# Altium schematic sheet 06_RFID_RTC_Storage.SchDoc: RFID_RTC_Storage
size A4; DrawnBy: YILDIRIM_DOGRU
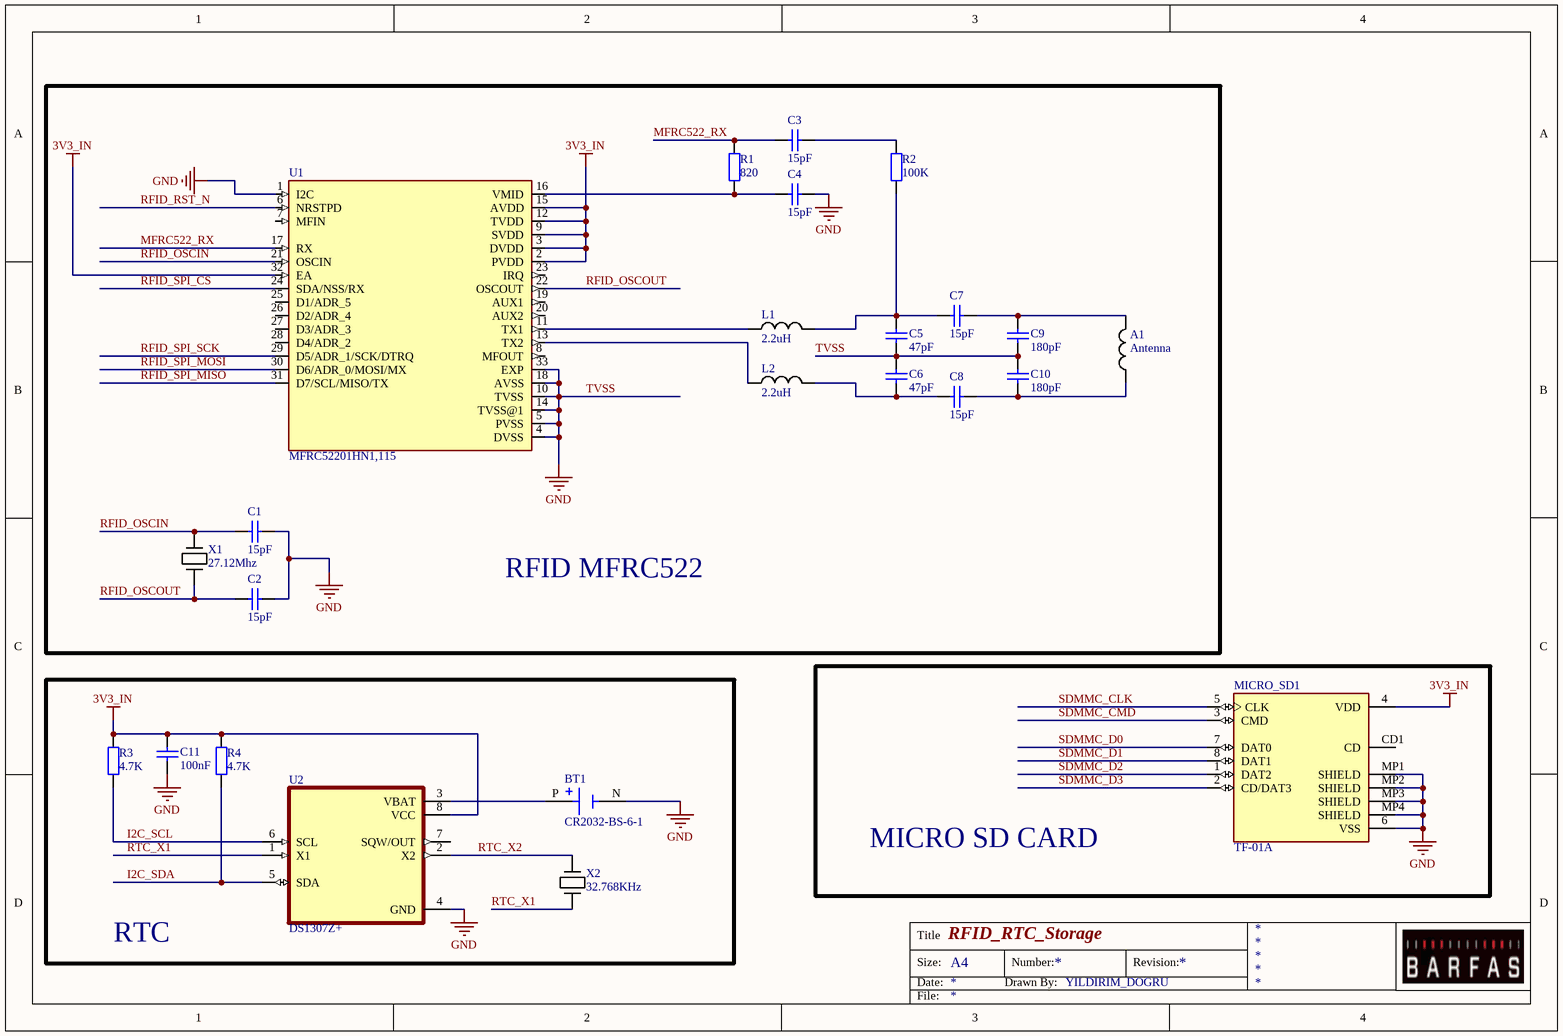
[diagram p0: 06_RFID_RTC_Storage.SchDoc]

## Parts
A1  Antenna  [TDK-VLS3012-1U]
BT1  CR2032-BS-6-1  [BAT_CR2032-BS-6-1]
C1  value 15pF  [RAD-0.3]  (hidden comment: Cap)
C2  value 15pF  [RAD-0.3]  (hidden comment: Cap)
C3  value 15pF  [RAD-0.3]  (hidden comment: Cap)
C4  value 15pF  [RAD-0.3]  (hidden comment: Cap)
C5  value 47pF  [RAD-0.3]  (hidden comment: Cap)
C6  value 47pF  [RAD-0.3]  (hidden comment: Cap)
C7  value 15pF  [RAD-0.3]  (hidden comment: Cap)
C8  value 15pF  [RAD-0.3]  (hidden comment: Cap)
C9  value 180pF  [RAD-0.3]  (hidden comment: Cap)
C10  value 180pF  [RAD-0.3]  (hidden comment: Cap)
C11  value 100nF  [RAD-0.3]  (hidden comment: Cap)
L1  2.2uH  [TDK-VLS3012-1U]
L2  2.2uH  [TDK-VLS3012-1U]
MICRO_SD1  TF-01A  [TF-01A]
R1  value 820  [AXIAL-0.4]  (hidden comment: R_CS)
R2  value 100K  [AXIAL-0.4]  (hidden comment: R_CS)
R3  value 4.7K  [AXIAL-0.4]  (hidden comment: R_CS)
R4  value 4.7K  [AXIAL-0.4]  (hidden comment: R_CS)
U1  MFRC52201HN1,115  [QFN50P500X500X100-33N]
U2  DS1307Z+  [SOIC127P600X175-8N]
X1  27.12Mhz  [XTAL-RU49/4]
X2  32.768KHz  [XTAL-RU49/4]

## Blocks framed on the sheet
RFID MFRC522: A1 C1-C10 L1 L2 R1 R2 U1 X1
MICRO SD CARD: MICRO_SD1
RTC: BT1 C11 R3 R4 U2 X2

## Nets
3V3_IN: C11.1 MICRO_SD1.4(VDD) R3.1 R4.1 U1.2(PVDD) U1.3(DVDD) U1.9(SVDD) U1.12(TVDD) U1.15(AVDD) U1.32(EA) U2.8(VCC)
TVSS: BT1.N(NEG) C1.1 C2.1 C4.1 C5.2 C6.1 C9.2 C10.1 C11.2 MICRO_SD1.6(VSS) MICRO_SD1.MP1(SHIELD) MICRO_SD1.MP2(SHIELD) MICRO_SD1.MP3(SHIELD) MICRO_SD1.MP4(SHIELD) U1.1(I2C) U1.4(DVSS) U1.5(PVSS) U1.10(TVSS) U1.14(TVSS@1) U1.18(AVSS) U1.33(EXP) U2.4(GND)  [also labelled GND]
I2C_SCL: R3.2 U2.6(SCL)
I2C_SDA: R4.2 U2.5(SDA)
MFRC522_RX: C3.2 R1.1 U1.17(RX)
RFID_OSCIN: C1.2 U1.21(OSCIN) X1.1
RFID_OSCOUT: C2.2 U1.22(OSCOUT) X1.2
RFID_RST_N: U1.6(NRSTPD)
RFID_SPI_CS: U1.24(SDA/NSS/RX)
RFID_SPI_MISO: U1.31(D7/SCL/MISO/TX)
RFID_SPI_MOSI: U1.30(D6/ADR_0/MOSI/MX)
RFID_SPI_SCK: U1.29(D5/ADR_1/SCK/DTRQ)
RTC_X1: U2.1(X1) X2.2
RTC_X2: U2.2(X2) X2.1
SDMMC_CLK: MICRO_SD1.5(CLK)
SDMMC_CMD: MICRO_SD1.3(CMD)
SDMMC_D0: MICRO_SD1.7(DAT0)
SDMMC_D1: MICRO_SD1.8(DAT1)
SDMMC_D2: MICRO_SD1.1(DAT2)
SDMMC_D3: MICRO_SD1.2(CD/DAT3)
NetA1_1: A1.1 C8.1 C10.2
NetA1_2: A1.2 C7.1 C9.1
NetBT1_P: BT1.P(POS) U2.3(VBAT)
NetC3_1: C3.1 R2.1
NetC4_2: C4.2 R1.2 U1.16(VMID)
NetC5_1: C5.1 C7.2 L1.2 R2.2
NetC6_2: C6.2 C8.2 L2.2
NetL1_1: L1.1 U1.11(TX1)
NetL2_1: L2.1 U1.13(TX2)

Not connected (* = marked no-connect by the designer): MICRO_SD1 CD1(CD); U1 7(MFIN) 8(MFOUT) 19(AUX1) 20(AUX2) 23(IRQ) 25(D1/ADR_5) 26(D2/ADR_4) 27(D3/ADR_3) 28(D4/ADR_2); U2 7(SQW/OUT)

## Notes on the sheet
- Title
- Size:
- Date:
- A4
- Drawn By:
- Number:
- Revision:
- File:

## Library data of the parts
A1 L1 L2 = 1U-VLS3012-TDK: TDK-VLS3012-1U; Manufacturer: TDK Corporation; Manufacturer Part Number: VLS3012T-1R0N2R2; Reel: L8; Supplier 1: Digi-Key; Supplier Part Number 1: 445-3682-2-ND
BT1 = CR2032-BS-6-1: Battery base CR2032 SMD Battery Connectors ROHS; MF: Shenzhen Q&J Electronics Co. Ltd; Package: Package; Check_prices: https://www.snapeda.com/parts/CR2032-BS-6-1/Shenzhen+Q%2526J+Electronics+Co.+Ltd/view-part/?ref=eda; SnapEDA_Link: https://www.snapeda.com/parts/CR2032-BS-6-1/Shenzhen+Q%2526J+Electronics+Co.+Ltd/view-part/?ref=snap; MP: CR2032-BS-6-1; Value: *; Availability: Not in stock; Price: None
C1-C11 = Cap: Capacitor; Published: 8-Jun-2000; LatestRevisionDate: 17-Jul-2002; LatestRevisionNote: Re-released for DXP Platform.; PackageReference: RAD-0.3; Publisher: Altium Limited; PackageDescription: Radial Cap, Thru-Hole; 2 Leads; 0.3 in Pin Spacing
MICRO_SD1 = TF-01A: Standard Card Edge Connectors; MF: HRO Electronics Co., Ltd.; Price: None; Availability: Not in stock; MP: TF-01A; Package: Package; SnapEDA_Link: https://www.snapeda.com/parts/TF-01A/HRO+Electronics+Co.%252C+Ltd./view-part/?ref=snap; Check_prices: https://www.snapeda.com/parts/TF-01A/HRO+Electronics+Co.%252C+Ltd./view-part/?ref=eda; Value: *
R1-R4 = Res2: Resistor; Published: 8-Jun-2000; LatestRevisionDate: 17-Jul-2002; LatestRevisionNote: Re-released for DXP Platform.; PackageReference: AXIAL-0.4; Publisher: Altium Limited; PackageDescription: Axial Device, Thru-Hole; 2 Leads; 0.4 in Pin Spacing
U1 = MFRC52201HN1,115: RFID Reader IC 13.56MHz ISO 14443, MIFARE IÂ²C, SPI, UART 2.5V ~ 3.3V 32-VFQFN Exposed Pad; MF: NXP Semiconductors; SnapEDA_Link: https://www.snapeda.com/parts/MFRC52201HN1,115/NXP+Semiconductors/view-part/?ref=snap; Package: VFQFN-32 NXP Semiconductors; Value: *; MP: MFRC52201HN1,115; Check_prices: https://www.snapeda.com/parts/MFRC52201HN1,115/NXP+Semiconductors/view-part/?ref=eda
U2 = DS1307Z+: 64 x 8, Serial, IÂ²C Real-Time Clock; MF: Analog Devices; SnapEDA_Link: https://www.snapeda.com/parts/DS1307Z+/Analog+Devices/view-part/?ref=snap; Package: SOIC-8 Maxim; Value: *; MP: DS1307Z+; Check_prices: https://www.snapeda.com/parts/DS1307Z+/Analog+Devices/view-part/?ref=eda
X1 X2 = CRYSTAL-GENERIC: GENERIC CRYSTAL